# EAGLE design arduino-shield-xyz-stepper (EAGLE 8.7.1)
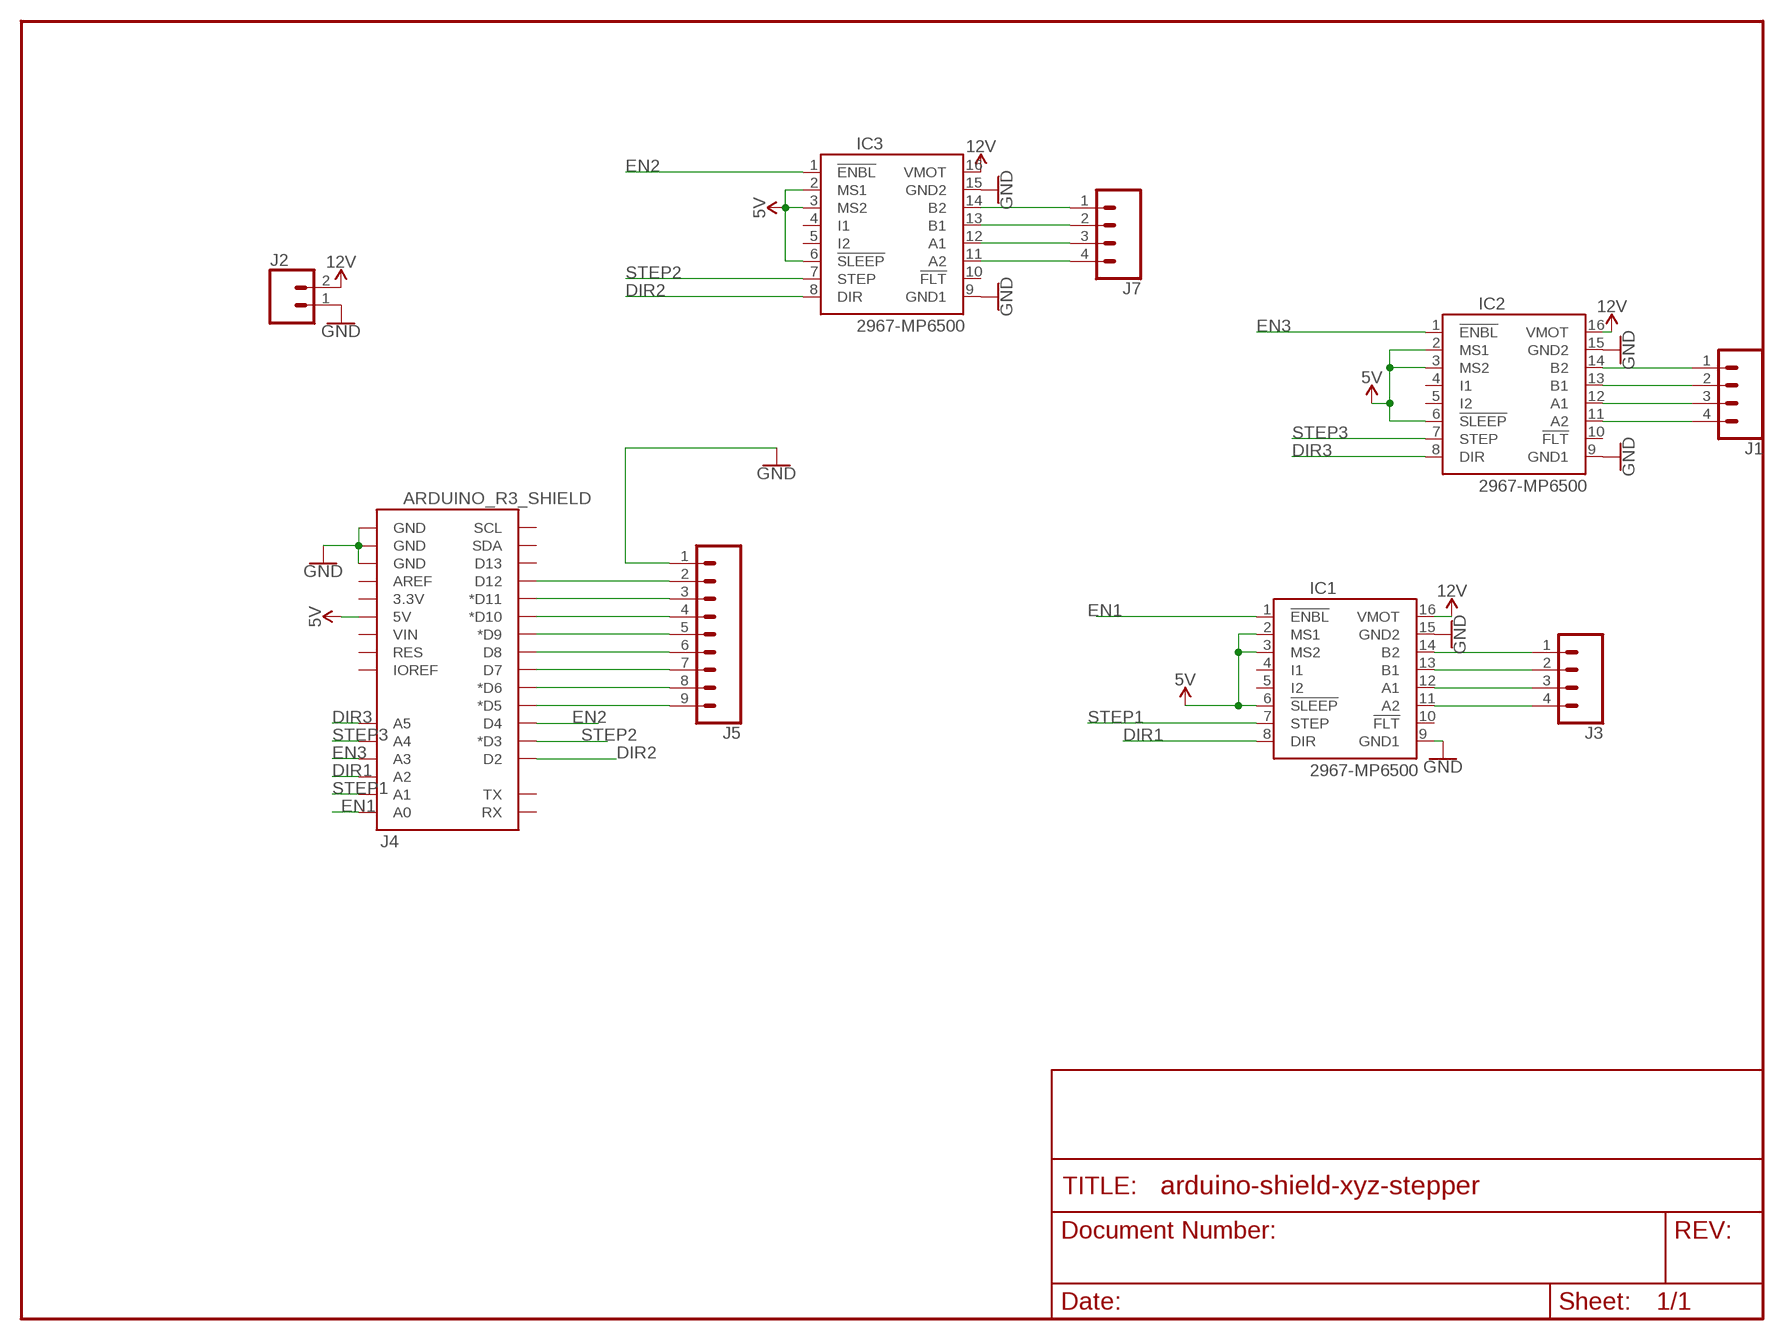
[diagram p0: schematic, sheet 1]

## Parts
IC1  2967-MP6500  [MP6500]
IC2  2967-MP6500  [MP6500]
IC3  2967-MP6500  [MP6500]
J1  CONN_04  [1X04]
J2  CONN_02  [1X02]
J3  CONN_04  [1X04]
J4  ARDUINO_R3_SHIELD  [UNO_R3_SHIELD]
J5  CONN_09  [1X09]
J7  CONN_04  [1X04]

## Nets
5V: IC1.2(MS1) IC1.3(MS2) IC1.6(!SLEEP) IC2.2(MS1) IC2.3(MS2) IC2.6(!SLEEP) IC3.2(MS1) IC3.3(MS2) IC3.6(!SLEEP) J4.5V
12V: IC1.16(VMOT) IC2.16(VMOT) IC3.16(VMOT) J2.2
DIR1: IC1.8(DIR) J4.A2
DIR2: IC3.8(DIR) J4.D2
DIR3: IC2.8(DIR) J4.A5
EN1: IC1.1(!ENBL) J4.A0
EN2: IC3.1(!ENBL) J4.D4
EN3: IC2.1(!ENBL) J4.A3
GND [vcc]: IC1.9(GND1) IC1.15(GND2) IC2.9(GND1) IC2.15(GND2) IC3.9(GND1) IC3.15(GND2) J2.1 J4.GND@0(GND) J4.GND@1(GND) J4.GND@2(GND) J5.1
N$1: IC3.14(B2) J7.1
N$4: IC3.13(B1) J7.2
N$5: IC1.14(B2) J3.1
N$6: IC1.13(B1) J3.2
N$7: IC1.12(A1) J3.3
N$8: IC1.11(A2) J3.4
N$9: IC2.14(B2) J1.1
N$10: IC2.13(B1) J1.2
N$11: IC2.12(A1) J1.3
N$12: IC2.11(A2) J1.4
N$13: IC3.12(A1) J7.3
N$14: IC3.11(A2) J7.4
N$16: J4.D12 J5.2
N$17: J4.D11(*D11) J5.3
N$18: J4.D10(*D10) J5.4
N$19: J4.D9(*D9) J5.5
N$22: J4.D8 J5.6
N$23: J4.D7 J5.7
N$24: J4.D6(*D6) J5.8
N$25: J4.D5(*D5) J5.9
STEP1: IC1.7(STEP) J4.A1
STEP2: IC3.7(STEP) J4.D3(*D3)
STEP3: IC2.7(STEP) J4.A4
Unconnected: IC1.4(I1) IC1.5(I2) IC1.10(!FLT) IC2.4(I1) IC2.5(I2) IC2.10(!FLT) IC3.4(I1) IC3.5(I2) IC3.10(!FLT) J4.3.3V J4.AREF J4.D13 J4.IOREF J4.RES J4.RX J4.SCL J4.SDA J4.TX J4.VIN

## Library data of the parts
IC1-IC3 = pololu-stepper-driver:2967-MP6500: MP6500 Stepper Motor Driver Carrier; Potentiometer Current Control (Header Pins Soldered) #2967 MP6500 Stepper Motor Driver Carrier; Potentiometer Current Control (Header Pins Soldered) <https://www.pololu.com/product/2967> in Japan, Suzaku Lab. Ltd. <https://suzakugiken.jp/> #2967 MP6500ステッピングモータドライバボード ポテンショメータ式電流制御 (ヘッダーピン実装済み) <https://szc.jp/po2967>
J1 J3 J7 = SparkFun-Connectors:CONN_04: Multi connection point. Often used as Generic Header-pin footprint for 0.1 inch spaced/style header connections On any of the 0.1 inch spaced packages, you can populate with these: Break Away Headers - Straight <https://www.sparkfun.com/products/116> (PRT-00116) Break Away Male Headers - Right Angle <https://www.sparkfun.com/products/553> (PRT-00553) Female Headers <https://www.sparkfun.com/products/115> (PRT-00115) Break Away Headers - Machine Pin <https://www.sparkfun.com/products/117> (PRT-00117) Break Away Female Headers - Swiss Machine Pin <https://www.sparkfun.com/products/743> (PRT-00743) For SCREWTERMINALS and SPRING TERMINALS visit here: Screw Terimnals on SparkFun.com <https://www.sparkfun.com/search/results?term=Screw+Terminals> (5mm/3.5mm/2.54mm spacing) This device is also useful as a general connection point to wire up your design to another part of your project. Our various solder wires solder well into these plated through hole pads. Hook-Up Wire - Assortment (Stranded, 22 AWG) <https://www.sparkfun.com/products/11375> (PRT-11375) Hook-Up Wire - Assortment (Solid Core, 22 AWG) <https://www.sparkfun.com/products/11367> (PRT-11367) View the entire wire category on our website here <https://www.sparkfun.com/categories/141> Special notes: Molex polarized connector foot print use with SKU : PRT-08231 with associated crimp pins and housings. 1MM SMD Version SKU: PRT-10208; PROD_ID: CONN-09696
J2 = SparkFun-Connectors:CONN_02: Multi connection point. Often used as Generic Header-pin footprint for 0.1 inch spaced/style header connections On any of the 0.1 inch spaced packages, you can populate with these: Break Away Headers - Straight <https://www.sparkfun.com/products/116> (PRT-00116) Break Away Male Headers - Right Angle <https://www.sparkfun.com/products/553> (PRT-00553) Female Headers <https://www.sparkfun.com/products/115> (PRT-00115) Break Away Headers - Machine Pin <https://www.sparkfun.com/products/117> (PRT-00117) Break Away Female Headers - Swiss Machine Pin <https://www.sparkfun.com/products/743> (PRT-00743) For SCREWTERMINALS and SPRING TERMINALS visit here: Screw Terimnals on SparkFun.com <https://www.sparkfun.com/search/results?term=Screw+Terminals> (5mm/3.5mm/2.54mm spacing) This device is also useful as a general connection point to wire up your design to another part of your project. Our various solder wires solder well into these plated through hole pads. Hook-Up Wire - Assortment (Stranded, 22 AWG) <https://www.sparkfun.com/products/11375> (PRT-11375) Hook-Up Wire - Assortment (Solid Core, 22 AWG) <https://www.sparkfun.com/products/11367> (PRT-11367) View the entire wire category on our website here <https://www.sparkfun.com/categories/141> Special notes: Molex polarized connector foot print use with: PRT-08233 with associated crimp pins and housings. 2.54_SCREWTERM for use with PRT-10571. 3.5mm Screw Terminal footprints for PRT-08084 5mm Screw Terminal footprints for use with PRT-08432
J4 = SparkFun-Boards:ARDUINO_R3_SHIELD: Shield form compatible with the Arduino Uno R3.
J5 = SparkFun-Connectors:CONN_09: Multi connection point. Often used as Generic Header-pin footprint for 0.1 inch spaced/style header connections On any of the 0.1 inch spaced packages, you can populate with these: Break Away Headers - Straight <https://www.sparkfun.com/products/116> (PRT-00116) Break Away Male Headers - Right Angle <https://www.sparkfun.com/products/553> (PRT-00553) Female Headers <https://www.sparkfun.com/products/115> (PRT-00115) Break Away Headers - Machine Pin <https://www.sparkfun.com/products/117> (PRT-00117) Break Away Female Headers - Swiss Machine Pin <https://www.sparkfun.com/products/743> (PRT-00743) For SCREWTERMINALS and SPRING TERMINALS visit here: Screw Terimnals on SparkFun.com <https://www.sparkfun.com/search/results?term=Screw+Terminals> (5mm/3.5mm/2.54mm spacing) This device is also useful as a general connection point to wire up your design to another part of your project. Our various solder wires solder well into these plated through hole pads. Hook-Up Wire - Assortment (Stranded, 22 AWG) <https://www.sparkfun.com/products/11375> (PRT-11375) Hook-Up Wire - Assortment (Solid Core, 22 AWG) <https://www.sparkfun.com/products/11367> (PRT-11367) View the entire wire category on our website here <https://www.sparkfun.com/categories/141> Special notes: Molex polarized connector foot print use with SKU : PRT-08231 with associated crimp pins and housings. 1MM SMD Version SKU: PRT-10208 NOTES ON THE VARIANTS LOCK and LOCK_LONGPADS... This footprint was designed to help hold the alignment of a through-hole component (i.e. 6-pin header) while soldering it into place. You may notice that each hole has been shifted either up or down by 0.005 of an inch from it's more standard position (which is a perfectly straight line). This slight alteration caused the pins (the squares in the middle) to touch the edges of the holes. Because they are alternating, it causes a "brace" to hold the component in place. 0.005 has proven to be the perfect amount of "off-center" position when using our standard breakaway headers. Although looks a little odd when you look at the bare footprint, once you have a header in there, the alteration is very hard to notice. Also,if you push a header all the way into place, it is covered up entirely on the bottom side.

## Net classes
0 Default: width 0.178 mm
1 vcc: width 0.178 mm

## Board
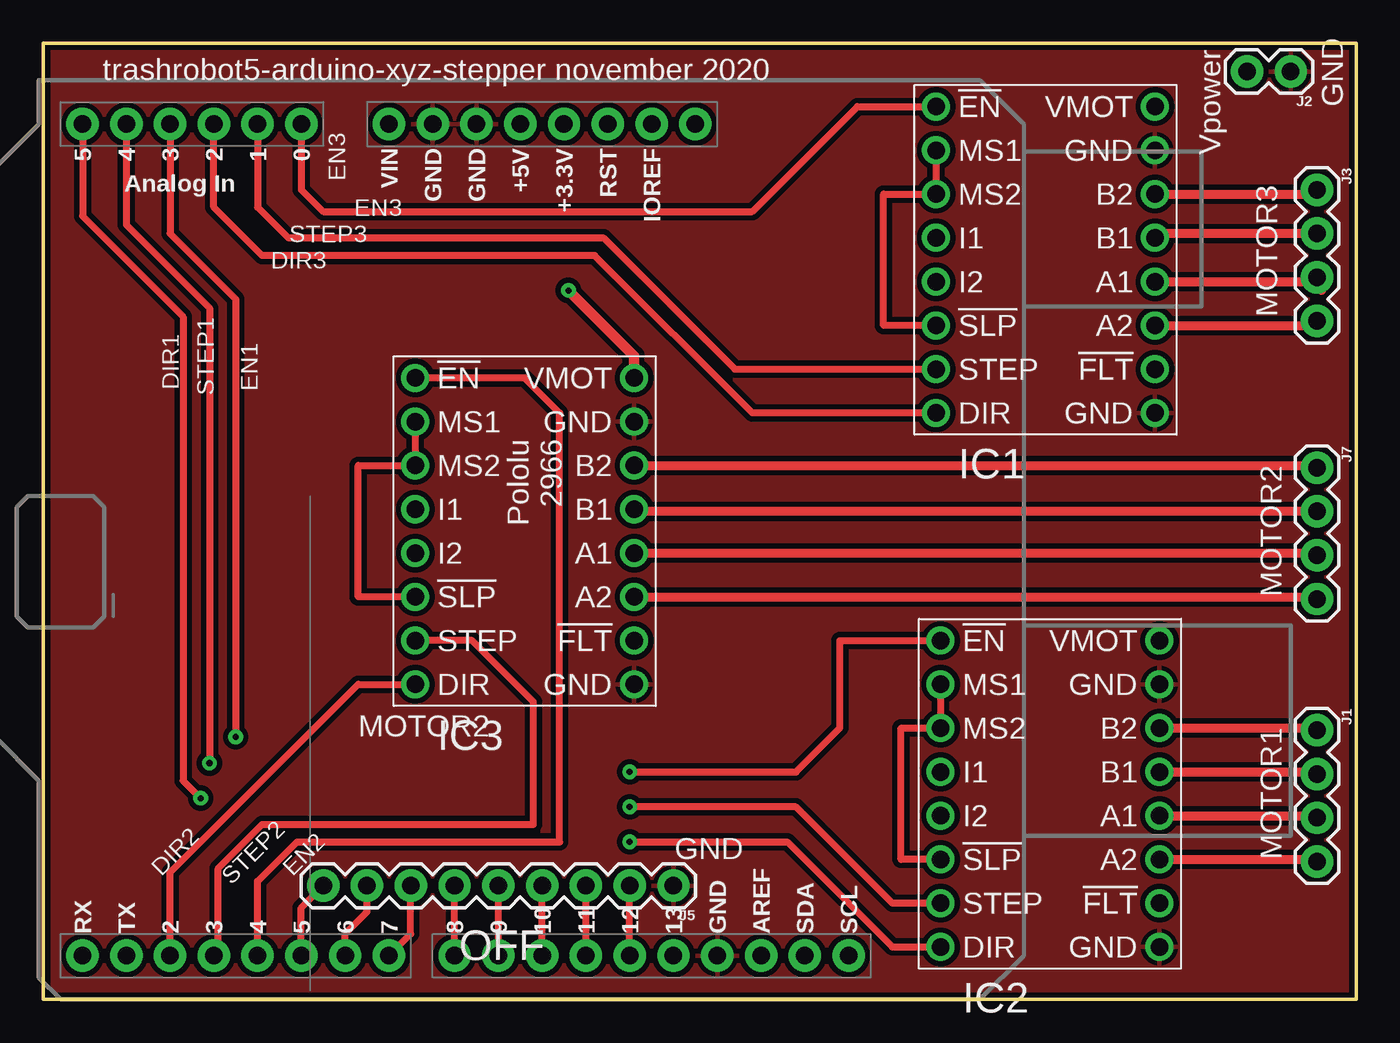
[diagram p1: board, top side]
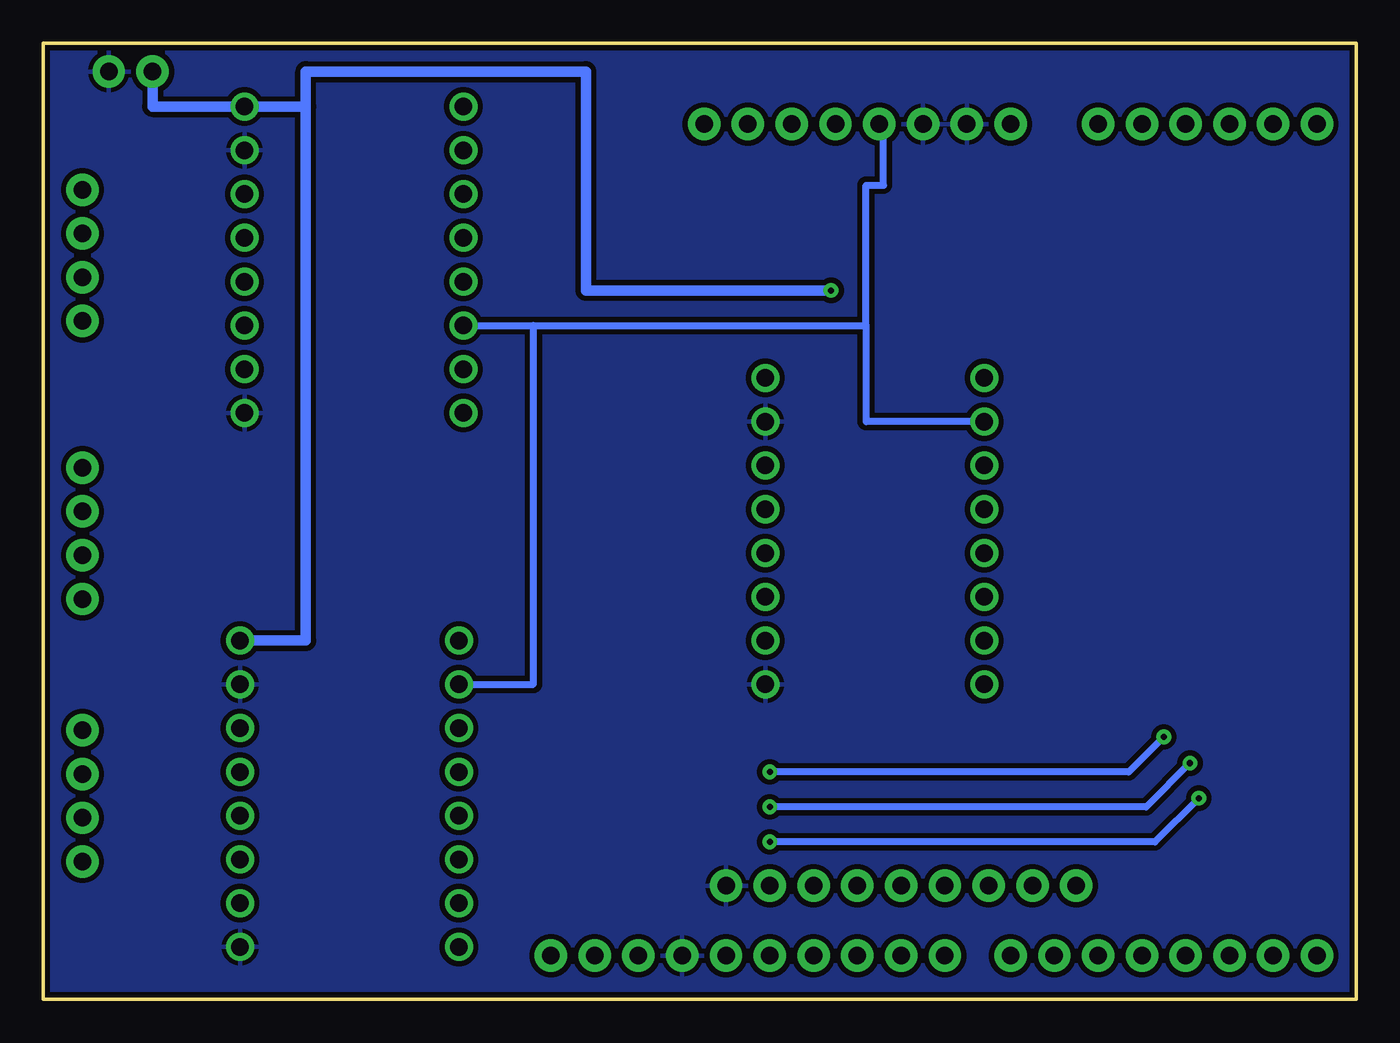
[diagram p2: board, bottom side, seen from below]

Size 76.2 x 55.5 mm. Coordinates in mm from the lower left corner, seen from the top.
Outline: 0,55.5 0,0 76.2,0 76.2,55.5 0,55.5
Copper layers (1*16): Top 0.035mm / dielectric 1.5mm / Bottom 0.035mm
Design rules "default": minimum track width 8mil, minimum drill 20mil, track to track 8mil, track to pad 8mil, pad to pad 8mil, via to via 8mil, smd to smd 8mil, copper to edge 10mil, drill to drill 8mil, minimum pad ring 12mil, minimum via ring 10mil, stop-mask expansion 4mil, vias tented up to drill 25mil, thermal gap 10mil

### Footprints (pad centres in the part's own frame; a part is rotated, then mirrored left to right if it is on the bottom)
MP6500 = drill 1.016: 1 -6.35,8.89; 2 -6.35,6.35; 3 -6.35,3.81; 4 -6.35,1.27; 5 -6.35,-1.27; 6 -6.35,-3.81; 7 -6.35,-6.35; 8 -6.35,-8.89; 9 6.35,-8.89; 10 6.35,-6.35; 11 6.35,-3.81; 12 6.35,-1.27; 13 6.35,1.27; 14 6.35,3.81; 15 6.35,6.35; 16 6.35,8.89
1X04 = drill 1.016 pad 1.88: 1 0,0; 2 2.54,0; 3 5.08,0; 4 7.62,0
1X02 = drill 1.016 pad 1.88: 1 0,0; 2 2.54,0
UNO_R3_SHIELD = drill 1.016 pad 1.88: 3.3V 50.8,26.67; 5V 50.8,29.21; A0 50.8,41.91; A1 50.8,44.45; A2 50.8,46.99; A3 50.8,49.53; A4 50.8,52.07; A5 50.8,54.61; AREF 2.54,15.24; D2 2.54,49.53; D3 2.54,46.99; D4 2.54,44.45; D5 2.54,41.91; D6 2.54,39.37; D7 2.54,36.83; D8 2.54,33.02; D9 2.54,30.48; D10 2.54,27.94; D11 2.54,25.4; D12 2.54,22.86; D13 2.54,20.32; GND@0 50.8,31.75; GND@1 50.8,34.29; GND@2 2.54,17.78; IOREF 50.8,21.59; NC 50.8,19.05; RES 50.8,24.13; RX 2.54,54.61; SCL 2.54,10.16; SDA 2.54,12.7; TX 2.54,52.07; VIN 50.8,36.83
1X09 = drill 1.016 pad 1.88: 1 0,0; 2 2.54,0; 3 5.08,0; 4 7.62,0; 5 10.16,0; 6 12.7,0; 7 15.24,0; 8 17.78,0; 9 20.32,0

### Placement (x,y rotation side)
IC1  58.17,42.93 0 top
IC2  58.42,11.94 0 top
IC3  27.94,27.18 0 top
J1  73.91,15.62 270 top
J2  72.39,53.85 180 top
J3  73.91,46.99 270 top
J4  56.9,0 90 top
J5  36.58,6.6 180 top
J7  73.91,30.86 270 top

### Tracks (layer width: path | path; a pad name or v marks a point on that pad's centre or on a via)
5V
  Top 0.406: IC3.2 IC3.3 18.29,30.99 18.29,23.37 IC3.6 | IC2.2 IC2.3 49.78,15.75 49.78,8.13 IC2.6 | IC1.2 IC1.3 48.77,46.74 48.77,39.12 IC1.6
  Bottom 0.406: IC3.2 28.45,33.53 28.45,39.12 | IC1.6 47.75,39.12 | 47.75,39.12 28.45,39.12 | IC2.2 47.75,18.29 47.75,39.12 | 28.45,39.12 28.45,47.24 27.43,47.24 27.43,50.8 J4.5V
12V  (via drill 0.35)
  Top 0.61: IC3.16 34.29,37.34 v30.48,41.15
  Bottom 0.61: v30.48,41.15 44.7,41.15 44.7,53.85 60.96,53.85 60.96,51.82 | IC2.16 60.96,20.83 60.96,51.82 | 60.96,51.82 IC1.16 69.85,51.82 J2.2
DIR1
  Top 0.406: IC1.8 41.15,34.04 32,43.18 12.7,43.18 9.91,45.97 J4.A2
DIR2
  Top 0.406: J4.D2 7.37,7.37 18.29,18.29 IC3.8
DIR3  (via drill 0.35)
  Top 0.406: J4.A5 2.29,45.47 8.13,39.62 8.13,12.7 v9.14,11.68 | v34.04,9.14 43.18,9.14 49.28,3.05 IC2.8
  Bottom 0.406: v9.14,11.68 11.68,9.14 v34.04,9.14
EN1
  Top 0.406: J4.A0 14.99,46.99 16.26,45.72 41.15,45.72 47.24,51.82 IC1.1
EN2
  Top 0.406: IC3.1 27.94,36.07 29.97,34.04 29.97,9.14 14.73,9.14 12.45,6.86 J4.D4
EN3  (via drill 0.35)
  Top 0.406: J4.A3 7.37,44.45 11.18,40.64 v11.18,15.24 | v34.04,13.21 43.69,13.21 46.23,15.75 46.23,20.83 IC2.1
  Bottom 0.406: v11.18,15.24 13.21,13.21 v34.04,13.21
GND
  pour Top (isolate 0.305): -0.76,55.63 76.45,56.13 76.45,-0.25 -0.25,-0.25
  pour Bottom (isolate 0.305): -0.75,55.37 76.32,55.88 76.45,0 -0.64,-0.51
N$1
  Top 0.508: IC3.14 73.79,30.99 J7.1
N$4
  Top 0.508: J7.2 34.42,28.32 IC3.13
N$5
  Top 0.508: IC1.14 73.66,46.74 J3.1
N$6
  Top 0.508: J3.2 64.77,44.45 IC1.13
N$7
  Top 0.508: IC1.12 73.66,41.66 73.91,41.4 | 74.17,41.15 73.91,41.4 | 73.91,41.4 J3.3
N$8
  Top 0.508: IC1.11 73.66,39.12 J3.4
N$9
  Top 0.508: IC2.14 73.79,15.75 J1.1
N$10
  Top 0.508: IC2.13 73.79,13.21 J1.2
N$11
  Top 0.508: IC2.12 73.79,10.67 J1.3
N$12
  Top 0.508: IC2.11 73.79,8.13 J1.4
N$13
  Top 0.508: IC3.12 73.79,25.91 J7.3
N$14
  Top 0.508: IC3.11 73.79,23.37 J7.4
N$16
  Top 0.406: J4.D12 J5.2
N$17
  Top 0.406: J4.D11 J5.3
N$18
  Top 0.406: J4.D10 J5.4
N$19
  Top 0.406: J4.D9 J5.5
N$22
  Top 0.406: J4.D8 J5.6
N$23
  Top 0.406: J4.D7 21.34,3.81 J5.7
N$24
  Top 0.406: J4.D6 17.53,3.81 18.8,5.08 J5.8
N$25
  Top 0.406: J4.D5 14.99,5.33 J5.9
STEP1
  Top 0.406: J4.A1 12.45,45.97 14.22,44.2 32.51,44.2 40.13,36.58 IC1.7
STEP2
  Top 0.406: J4.D3 10.16,2.79 10.16,7.62 12.7,10.16 28.45,10.16 28.45,17.27 24.89,20.83 IC3.7
STEP3  (via drill 0.35)
  Top 0.406: J4.A4 4.83,44.96 9.65,40.13 v9.65,13.72 | IC2.7 49.28,5.59 43.69,11.18 v34.04,11.18
  Bottom 0.406: v9.65,13.72 12.19,11.18 v34.04,11.18

### Text on the board
tPlace: trashrobot5-arduino-xyz-stepper november 2020 | GND | EN3 | Vpower | EN3 | STEP3 | DIR3 | MOTOR3 | DIR1 | EN1 | STEP1 | Pololu / 2966 | MOTOR2 | MOTOR2 | GND | MOTOR1 | DIR2 | STEP2 | EN2 | OFF
tValues: Tent Vias! | Arduino Wee v1.3